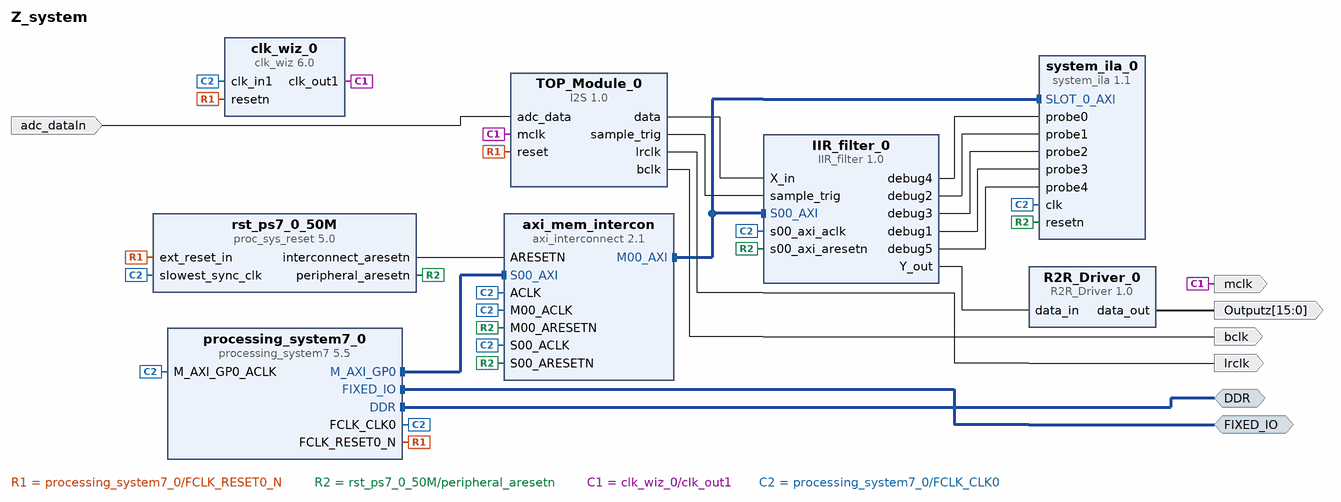
[diagram p0: block diagram of the top level]
# Vivado block design Z_system, xc7z007sclg225-1, Vivado 2019.1
create_bd_design Z_system

create_bd_intf_port -mode Master -vlnv xilinx.com:interface:ddrx_rtl:1.0 DDR
create_bd_intf_port -mode Master -vlnv xilinx.com:display_processing_system7:fixedio_rtl:1.0 FIXED_IO
create_bd_port -dir O -from 15 -to 0 Outputz
create_bd_port -dir O bclk
create_bd_port -dir O lrclk
create_bd_port -dir O mclk
create_bd_port -dir I adc_dataIn

create_bd_cell -type ip -vlnv xilinx.com:ip:processing_system7:5.5 processing_system7_0
set_property -dict [list \
  CONFIG.PCW_FPGA0_PERIPHERAL_FREQMHZ 50 \
  CONFIG.PCW_FPGA1_PERIPHERAL_FREQMHZ 200 \
  CONFIG.PCW_FPGA3_PERIPHERAL_FREQMHZ 25 \
  CONFIG.PCW_GPIO_MIO_GPIO_ENABLE 1 \
  CONFIG.PCW_GPIO_MIO_GPIO_IO MIO \
  CONFIG.PCW_I2C_RESET_ENABLE 0 \
  CONFIG.PCW_QSPI_GRP_FBCLK_ENABLE 1 \
  CONFIG.PCW_QSPI_GRP_FBCLK_IO {MIO 8} \
  CONFIG.PCW_QSPI_GRP_SINGLE_SS_ENABLE 1 \
  CONFIG.PCW_QSPI_GRP_SINGLE_SS_IO {MIO 1 .. 6} \
  CONFIG.PCW_QSPI_PERIPHERAL_ENABLE 1 \
  CONFIG.PCW_QSPI_QSPI_IO {MIO 1 .. 6} \
  CONFIG.PCW_SINGLE_QSPI_DATA_MODE x4 \
  CONFIG.PCW_UART1_PERIPHERAL_ENABLE 1 \
  CONFIG.PCW_UART1_UART1_IO {MIO 48 .. 49} \
  CONFIG.PCW_UART_PERIPHERAL_FREQMHZ 100 \
  CONFIG.PCW_UIPARAM_DDR_MEMORY_TYPE {DDR 3 (Low Voltage)} \
  CONFIG.PCW_UIPARAM_DDR_PARTNO {MT41K256M16 RE-125} \
  CONFIG.PCW_USB0_PERIPHERAL_ENABLE 0 \
  CONFIG.PCW_USB_RESET_ENABLE 1 \
] [get_bd_cells processing_system7_0]
# 149 more settings of processing_system7_0 are not shown: defaults, MIO pin electricals, DDR timing, and values the tool derives
create_bd_cell -type ip -vlnv xilinx.com:ip:axi_interconnect:2.1 axi_mem_intercon
set_property -dict {CONFIG.NUM_MI 1} [get_bd_cells axi_mem_intercon]
create_bd_cell -type ip -vlnv xilinx.com:ip:proc_sys_reset:5.0 rst_ps7_0_50M
create_bd_cell -type ip -vlnv xilinx.com:user:IIR_filter:1.0 IIR_filter_0
create_bd_cell -type ip -vlnv xilinx.com:user:R2R_Driver:1.0 R2R_Driver_0
create_bd_cell -type ip -vlnv xilinx.com:ip:clk_wiz:6.0 clk_wiz_0
set_property -dict [list \
  CONFIG.CLKOUT1_JITTER 373.299 \
  CONFIG.CLKOUT1_PHASE_ERROR 409.976 \
  CONFIG.CLKOUT1_REQUESTED_OUT_FREQ 12.288 \
  CONFIG.MMCM_CLKFBOUT_MULT_F 61.000 \
  CONFIG.MMCM_CLKOUT0_DIVIDE_F 82.750 \
  CONFIG.MMCM_DIVCLK_DIVIDE 3 \
  CONFIG.RESET_PORT resetn \
  CONFIG.RESET_TYPE ACTIVE_LOW \
  CONFIG.USE_LOCKED false \
] [get_bd_cells clk_wiz_0]
create_bd_cell -type ip -vlnv xilinx.com:ip:system_ila:1.1 system_ila_0
set_property -dict [list \
  CONFIG.C_MON_TYPE MIX \
  CONFIG.C_NUM_MONITOR_SLOTS 1 \
  CONFIG.C_NUM_OF_PROBES 5 \
  CONFIG.C_PROBE0_TYPE 0 \
  CONFIG.C_PROBE1_TYPE 0 \
  CONFIG.C_PROBE2_TYPE 0 \
  CONFIG.C_PROBE3_TYPE 0 \
  CONFIG.C_PROBE4_TYPE 0 \
  CONFIG.C_SLOT_0_APC_EN 0 \
  CONFIG.C_SLOT_0_AXI_AR_SEL_DATA 1 \
  CONFIG.C_SLOT_0_AXI_AR_SEL_TRIG 1 \
  CONFIG.C_SLOT_0_AXI_AW_SEL_DATA 1 \
  CONFIG.C_SLOT_0_AXI_AW_SEL_TRIG 1 \
  CONFIG.C_SLOT_0_AXI_B_SEL_DATA 1 \
  CONFIG.C_SLOT_0_AXI_B_SEL_TRIG 1 \
  CONFIG.C_SLOT_0_AXI_R_SEL_DATA 1 \
  CONFIG.C_SLOT_0_AXI_R_SEL_TRIG 1 \
  CONFIG.C_SLOT_0_AXI_W_SEL_DATA 1 \
  CONFIG.C_SLOT_0_AXI_W_SEL_TRIG 1 \
  CONFIG.C_SLOT_0_INTF_TYPE xilinx.com:interface:aximm_rtl:1.0 \
] [get_bd_cells system_ila_0]
create_bd_cell -type ip -vlnv xilinx.com:user:I2S:1.0 TOP_Module_0

# ---- connections ----

connect_bd_intf_net -intf_net axi_mem_intercon_M00_AXI [get_bd_intf_pins axi_mem_intercon/M00_AXI] [get_bd_intf_pins IIR_filter_0/S00_AXI]
connect_bd_intf_net [get_bd_intf_pins axi_mem_intercon/M00_AXI] [get_bd_intf_pins system_ila_0/SLOT_0_AXI]
connect_bd_intf_net [get_bd_intf_ports FIXED_IO] [get_bd_intf_pins processing_system7_0/FIXED_IO]
connect_bd_intf_net [get_bd_intf_pins processing_system7_0/M_AXI_GP0] [get_bd_intf_pins axi_mem_intercon/S00_AXI]
connect_bd_intf_net [get_bd_intf_ports DDR] [get_bd_intf_pins processing_system7_0/DDR]
connect_bd_net [get_bd_pins processing_system7_0/FCLK_RESET0_N] \
  [get_bd_pins rst_ps7_0_50M/ext_reset_in] [get_bd_pins clk_wiz_0/resetn] [get_bd_pins TOP_Module_0/reset]
connect_bd_net [get_bd_pins rst_ps7_0_50M/peripheral_aresetn] \
  [get_bd_pins axi_mem_intercon/S00_ARESETN] [get_bd_pins axi_mem_intercon/M00_ARESETN] \
  [get_bd_pins IIR_filter_0/s00_axi_aresetn] [get_bd_pins system_ila_0/resetn]
connect_bd_net [get_bd_pins rst_ps7_0_50M/interconnect_aresetn] [get_bd_pins axi_mem_intercon/ARESETN]
connect_bd_net [get_bd_pins IIR_filter_0/Y_out] [get_bd_pins R2R_Driver_0/data_in]
connect_bd_net [get_bd_ports adc_dataIn] [get_bd_pins TOP_Module_0/adc_data]
connect_bd_net [get_bd_pins TOP_Module_0/data] [get_bd_pins IIR_filter_0/X_in]
connect_bd_net [get_bd_pins TOP_Module_0/sample_trig] [get_bd_pins IIR_filter_0/sample_trig]
connect_bd_net [get_bd_pins clk_wiz_0/clk_out1] [get_bd_ports mclk] [get_bd_pins TOP_Module_0/mclk]
connect_bd_net [get_bd_pins TOP_Module_0/lrclk] [get_bd_ports lrclk]
connect_bd_net [get_bd_pins TOP_Module_0/bclk] [get_bd_ports bclk]
connect_bd_net [get_bd_pins R2R_Driver_0/data_out] [get_bd_ports Outputz]
connect_bd_net -net debug4 [get_bd_pins IIR_filter_0/debug4] [get_bd_pins system_ila_0/probe0]
connect_bd_net -net debug2 [get_bd_pins IIR_filter_0/debug2] [get_bd_pins system_ila_0/probe1]
connect_bd_net -net debug3 [get_bd_pins IIR_filter_0/debug3] [get_bd_pins system_ila_0/probe2]
connect_bd_net -net debug1 [get_bd_pins IIR_filter_0/debug1] [get_bd_pins system_ila_0/probe3]
connect_bd_net -net debug5 [get_bd_pins IIR_filter_0/debug5] [get_bd_pins system_ila_0/probe4]
connect_bd_net [get_bd_pins processing_system7_0/FCLK_CLK0] \
  [get_bd_pins axi_mem_intercon/ACLK] [get_bd_pins axi_mem_intercon/S00_ACLK] \
  [get_bd_pins processing_system7_0/M_AXI_GP0_ACLK] [get_bd_pins axi_mem_intercon/M00_ACLK] \
  [get_bd_pins IIR_filter_0/s00_axi_aclk] [get_bd_pins clk_wiz_0/clk_in1] [get_bd_pins rst_ps7_0_50M/slowest_sync_clk] \
  [get_bd_pins system_ila_0/clk]
set_property HDL_ATTRIBUTE.BMM_INFO_PROCESSOR {arm > Z_system axi_bram_ctrl_0} [get_bd_cells processing_system7_0]
set_property HDL_ATTRIBUTE.KEEP_HIERARCHY yes [get_bd_cells processing_system7_0]
set_property HDL_ATTRIBUTE.DEBUG true [get_bd_intf_nets axi_mem_intercon_M00_AXI]
set_property HDL_ATTRIBUTE.MARK_DEBUG true [get_bd_intf_nets axi_mem_intercon_M00_AXI]
set_property HDL_ATTRIBUTE.DEBUG true [get_bd_nets debug4]
set_property HDL_ATTRIBUTE.MARK_DEBUG true [get_bd_nets debug4]
set_property HDL_ATTRIBUTE.DEBUG true [get_bd_nets debug2]
set_property HDL_ATTRIBUTE.MARK_DEBUG true [get_bd_nets debug2]
set_property HDL_ATTRIBUTE.DEBUG true [get_bd_nets debug3]
set_property HDL_ATTRIBUTE.MARK_DEBUG true [get_bd_nets debug3]
set_property HDL_ATTRIBUTE.DEBUG true [get_bd_nets debug1]
set_property HDL_ATTRIBUTE.MARK_DEBUG true [get_bd_nets debug1]
set_property HDL_ATTRIBUTE.DEBUG true [get_bd_nets debug5]
set_property HDL_ATTRIBUTE.MARK_DEBUG true [get_bd_nets debug5]

# ---- address map ----
assign_bd_address -offset 0x43C00000 -range 64K -target_address_space [get_bd_addr_spaces processing_system7_0/Data] [get_bd_addr_segs IIR_filter_0/S00_AXI/S00_AXI_reg]

validate_bd_design
save_bd_design
